# EAGLE design ZsenzorNou (EAGLE 6.5.0)
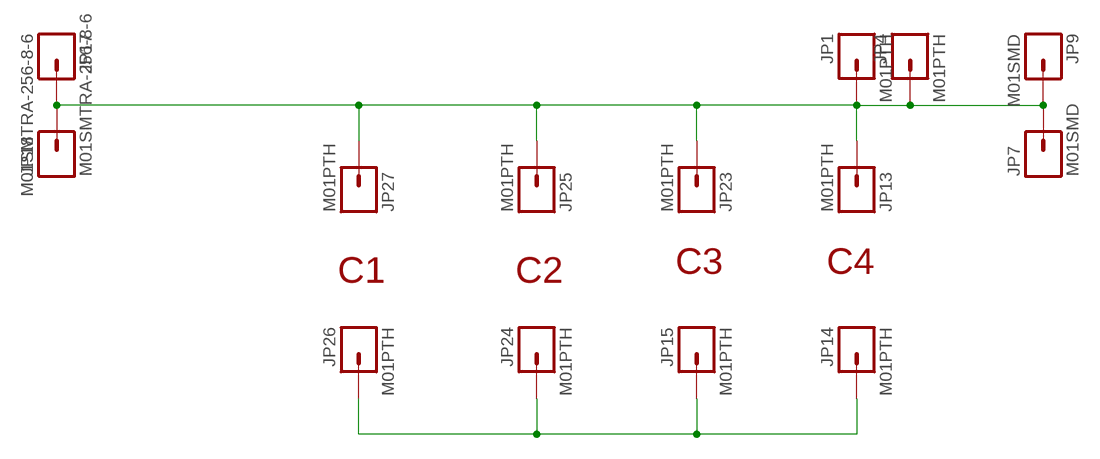
[diagram p0: schematic, sheet 1]

## Parts
JP1  M01PTH  [1X01]
JP4  M01PTH  [1X01]
JP7  M01SMD  [LUXEON-PAD]
JP9  M01SMD  [LUXEON-PAD]
JP13  M01PTH  [1X01]
JP14  M01PTH  [1X01]
JP15  M01PTH  [1X01]
JP17  M01SMTRA-256-8-6  [SMTRA-256-8-6]
JP18  M01SMTRA-256-8-6  [SMTRA-256-8-6]
JP23  M01PTH  [1X01]
JP24  M01PTH  [1X01]
JP25  M01PTH  [1X01]
JP26  M01PTH  [1X01]
JP27  M01PTH  [1X01]

## Nets
GND: JP14.1 JP15.1 JP24.1 JP26.1
N$4: JP1.1 JP4.1 JP7.P$1 JP9.P$1 JP13.1 JP17.P$1 JP18.P$1 JP23.1 JP25.1 JP27.1

## Notes on the sheet
- C1 | C2 | C3 | C4

## Library data of the parts
JP1 JP4 JP7 JP9 JP13-JP15 JP17 JP18 JP23-JP27 = SparkFun-Connectors:M01: Header 1 Standard 1-pin 0.1" header. Use with straight break away headers (SKU : PRT-00116), right angle break away headers (PRT-00553), swiss pins (PRT-00743), machine pins (PRT-00117), and female headers (PRT-00115).

## Board
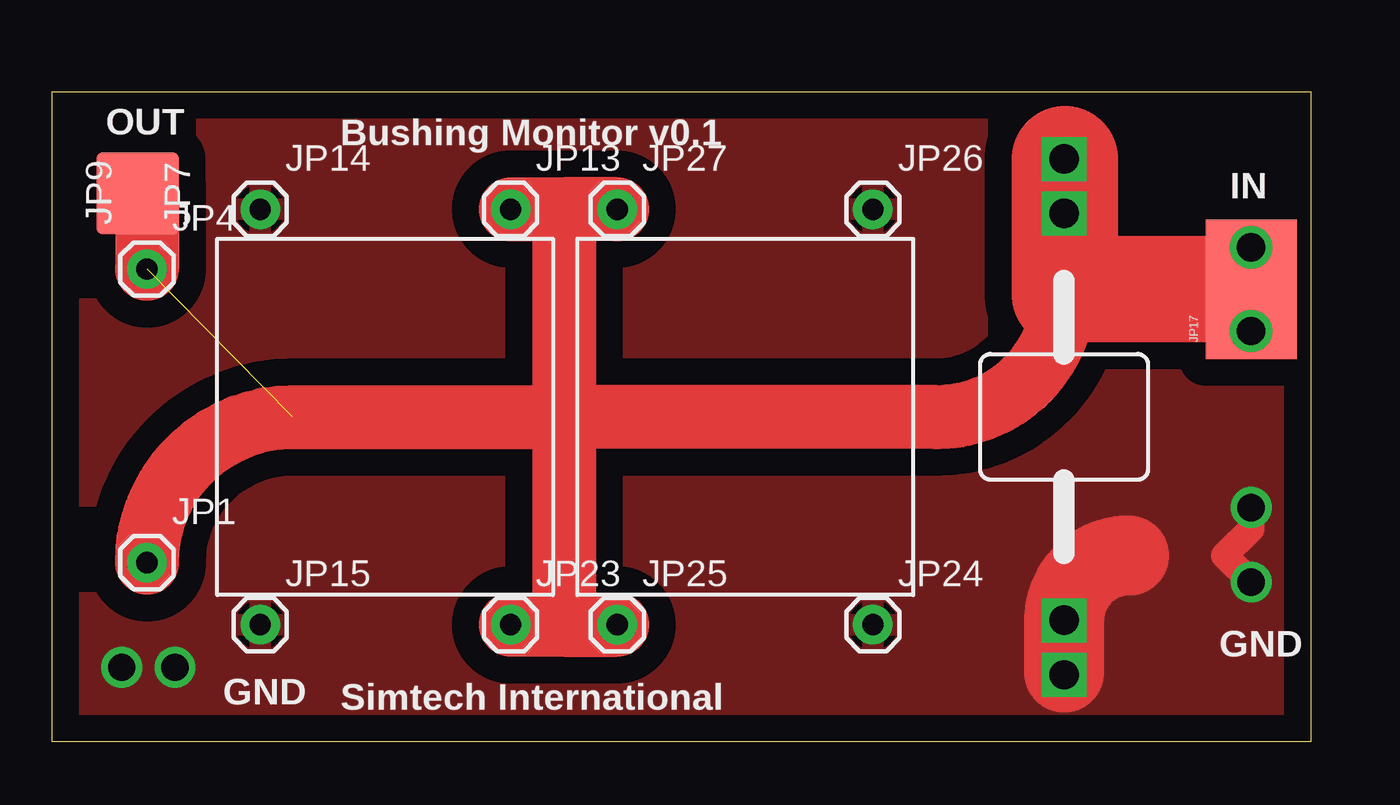
[diagram p1: board, top side]
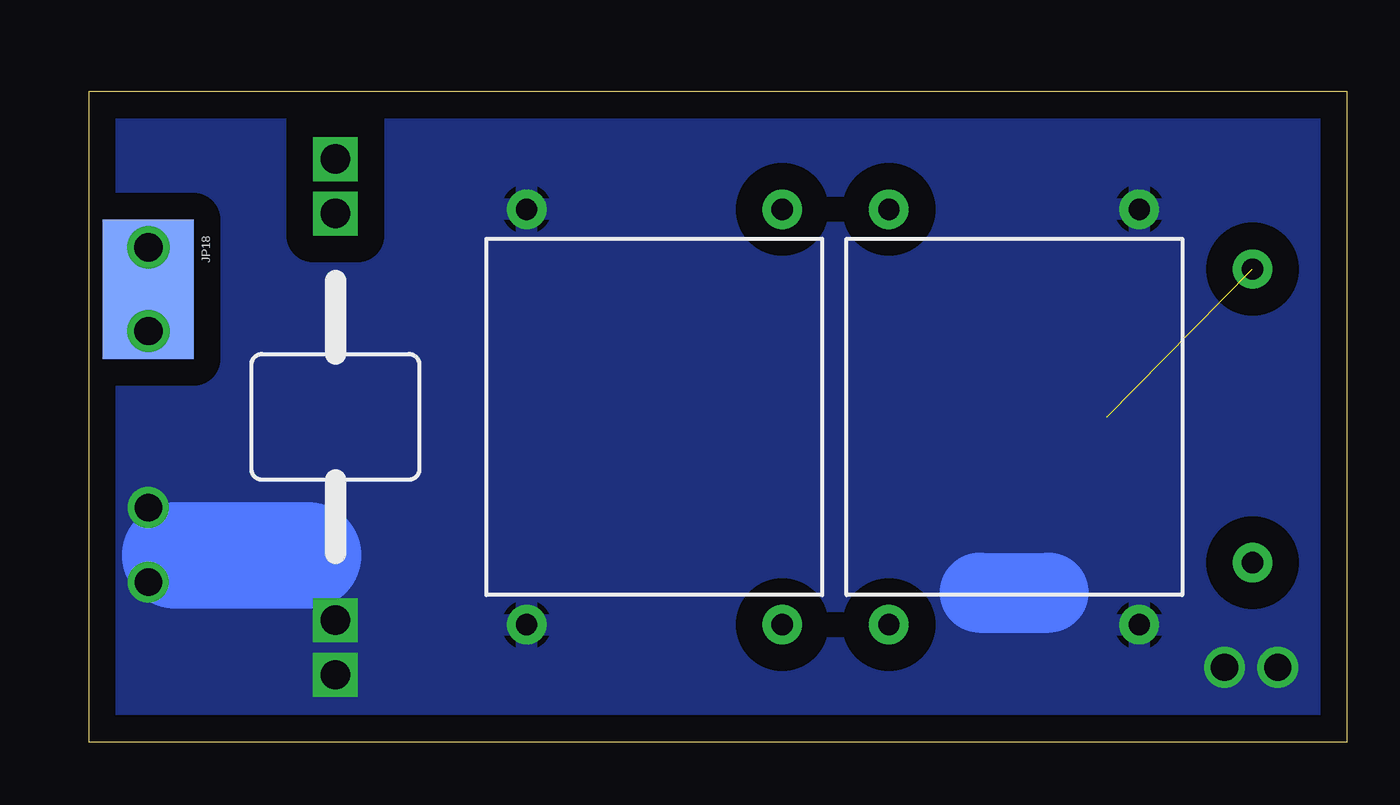
[diagram p2: board, bottom side, seen from below]

Size 60 x 31 mm. Coordinates in mm from the lower left corner, seen from the top.
Outline: 0,0 0,31 60,31 60,0 0,0
Copper layers (1*16): Top 0.035mm / dielectric 1.5mm / Bottom 0.035mm
Design rules "default": minimum track width 10mil, minimum drill 24mil, track to track 8mil, track to pad 8mil, pad to pad 8mil, via to via 8mil, smd to smd 8mil, copper to edge 40mil, drill to drill 8mil, minimum pad ring 10mil, minimum via ring 8mil, stop-mask expansion 4mil, vias tented up to drill 0mil, thermal gap 10mil

### Footprints (pad centres in the part's own frame; a part is rotated, then mirrored left to right if it is on the bottom)
1X01 = drill 1.016 pad 1.88: 1 0,0
LUXEON-PAD = smd 3.9 x 2.4: P$1 0,0
SMTRA-256-8-6 = drill 1.346: P$1 -1.994,0; P$2 1.994,0 | smd 6.655 x 4.343: P$3 0,0

### Placement (x,y rotation side)
JP1  4.51,8.55 0 top
JP4  4.51,22.55 0 top
JP7  3.3,26.16 270 top
JP9  4.83,26.16 90 top
JP13  21.84,25.4 0 top
JP14  9.91,25.4 0 top
JP15  9.91,5.59 0 top
JP17  57.15,21.59 90 top
JP18  57.15,21.59 270 bottom
JP23  21.84,5.59 0 top
JP24  39.12,5.59 0 top
JP25  26.92,5.59 0 top
JP26  39.12,25.4 0 top
JP27  26.92,25.4 0 top

### Tracks (layer width: path | path; a pad name or v marks a point on that pad's centre or on a via)
GND  (via drill 1.3, 1.4)
  Top 1.27: v57.15,7.62 55.88,8.89 57.15,10.16 v57.15,11.18
  Top 3.81: 48.23,3.3 v48.23,5.8 arc-90 51.32,8.89
  Bottom 3.81: 17.53,7.11 14.22,7.11
  Bottom 5.08: 55.88,8.89 49.53,8.89
  other vias: 48.23,3.2 3.3,3.56 5.84,3.56
  pour Bottom (isolate 1.27): 0,31 60,31 60,0 0,0
  pour Top (isolate 1.27): 0,31 60,31 60,0 0,0
N$4  (1 unrouted)
  Top 1.27: JP18.P$1 56.13,22.57 56.13,22.35 56.9,21.59 | JP17.P$1 56.13,20.61 56.13,21.08 56.64,21.59 | JP7.P$1 JP9.P$1 4.51,26.48
  Top 3.048: JP13.1 24.38,25.4 | 24.38,25.4 24.38,15.49 | 24.38,15.49 24.38,5.59 | 24.38,5.59 JP23.1 | 24.38,5.59 JP25.1 | JP27.1 24.38,25.4 | 24.38,15.49 42.16,15.49 arc90 48.26,21.59 | 56.64,21.59 56.9,21.59 57.15,21.59 | JP1.1 arc-90 11.45,15.49 24.38,15.49 | 4.51,26.48 JP4.1
  Top 5.08: 48.26,21.59 56.64,21.59
SIG  (via drill 1.4)
  Top 1.27: v48.23,25.2 v48.23,27.8 48.26,27.8
  Top 3.048: 48.26,27.8 48.26,28.19
  Top 5.08: 48.26,21.34 48.26,27.8

### Text on the board
tPlace: OUT | Bushing Monitor v0.1 | IN | GND | GND | Simtech International